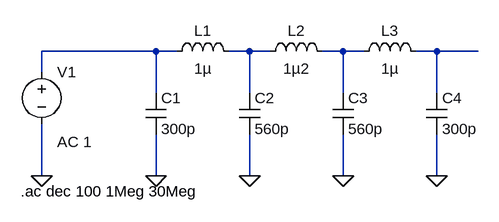
[diagram p0: schematic filter_30m.asc]
filter_30m.asc, the LTspice schematic file:
Version 4
SHEET 1 880 680
WIRE 208 96 32 96
WIRE 240 96 208 96
WIRE 352 96 320 96
WIRE 384 96 352 96
WIRE 496 96 464 96
WIRE 528 96 496 96
WIRE 640 96 608 96
WIRE 704 96 640 96
WIRE 32 128 32 96
WIRE 208 160 208 96
WIRE 352 160 352 96
WIRE 496 160 496 96
WIRE 640 160 640 96
WIRE 32 288 32 208
WIRE 208 288 208 224
WIRE 352 288 352 224
WIRE 496 288 496 224
WIRE 640 288 640 224
FLAG 32 288 0
FLAG 208 288 0
FLAG 352 288 0
FLAG 496 288 0
FLAG 640 288 0
SYMBOL voltage 32 112 R0
WINDOW 123 24 124 Left 2
WINDOW 39 0 0 Left 0
SYMATTR Value2 AC 1
SYMATTR InstName V1
SYMATTR Value ""
SYMBOL cap 192 160 R0
SYMATTR InstName C1
SYMATTR Value 300p
SYMBOL cap 336 160 R0
SYMATTR InstName C2
SYMATTR Value 560p
SYMBOL cap 480 160 R0
SYMATTR InstName C3
SYMATTR Value 560p
SYMBOL cap 624 160 R0
SYMATTR InstName C4
SYMATTR Value 300p
SYMBOL ind 224 112 R270
WINDOW 0 32 56 VTop 2
WINDOW 3 5 56 VBottom 2
SYMATTR InstName L1
SYMATTR Value 1µ
SYMBOL ind 368 112 R270
WINDOW 0 32 56 VTop 2
WINDOW 3 5 56 VBottom 2
SYMATTR InstName L2
SYMATTR Value 1µ2
SYMBOL ind 512 112 R270
WINDOW 0 32 56 VTop 2
WINDOW 3 5 56 VBottom 2
SYMATTR InstName L3
SYMATTR Value 1µ
TEXT 0 312 Left 2 !.ac dec 100 1Meg 30Meg

The netlist it stands for:
* filter_30m.asc
V1 N001 0 AC 1
C1 N001 0 300p
C2 N002 0 560p
C3 N003 0 560p
C4 N004 0 300p
L1 N001 N002 1µ
L2 N002 N003 1µ2
L3 N003 N004 1µ
.ac dec 100 1Meg 30Meg
.backanno
.end